# Altium schematic sheet LSM6DSOTR.SchDoc
size A3; SheetNumber: 4; SheetTotal: 7
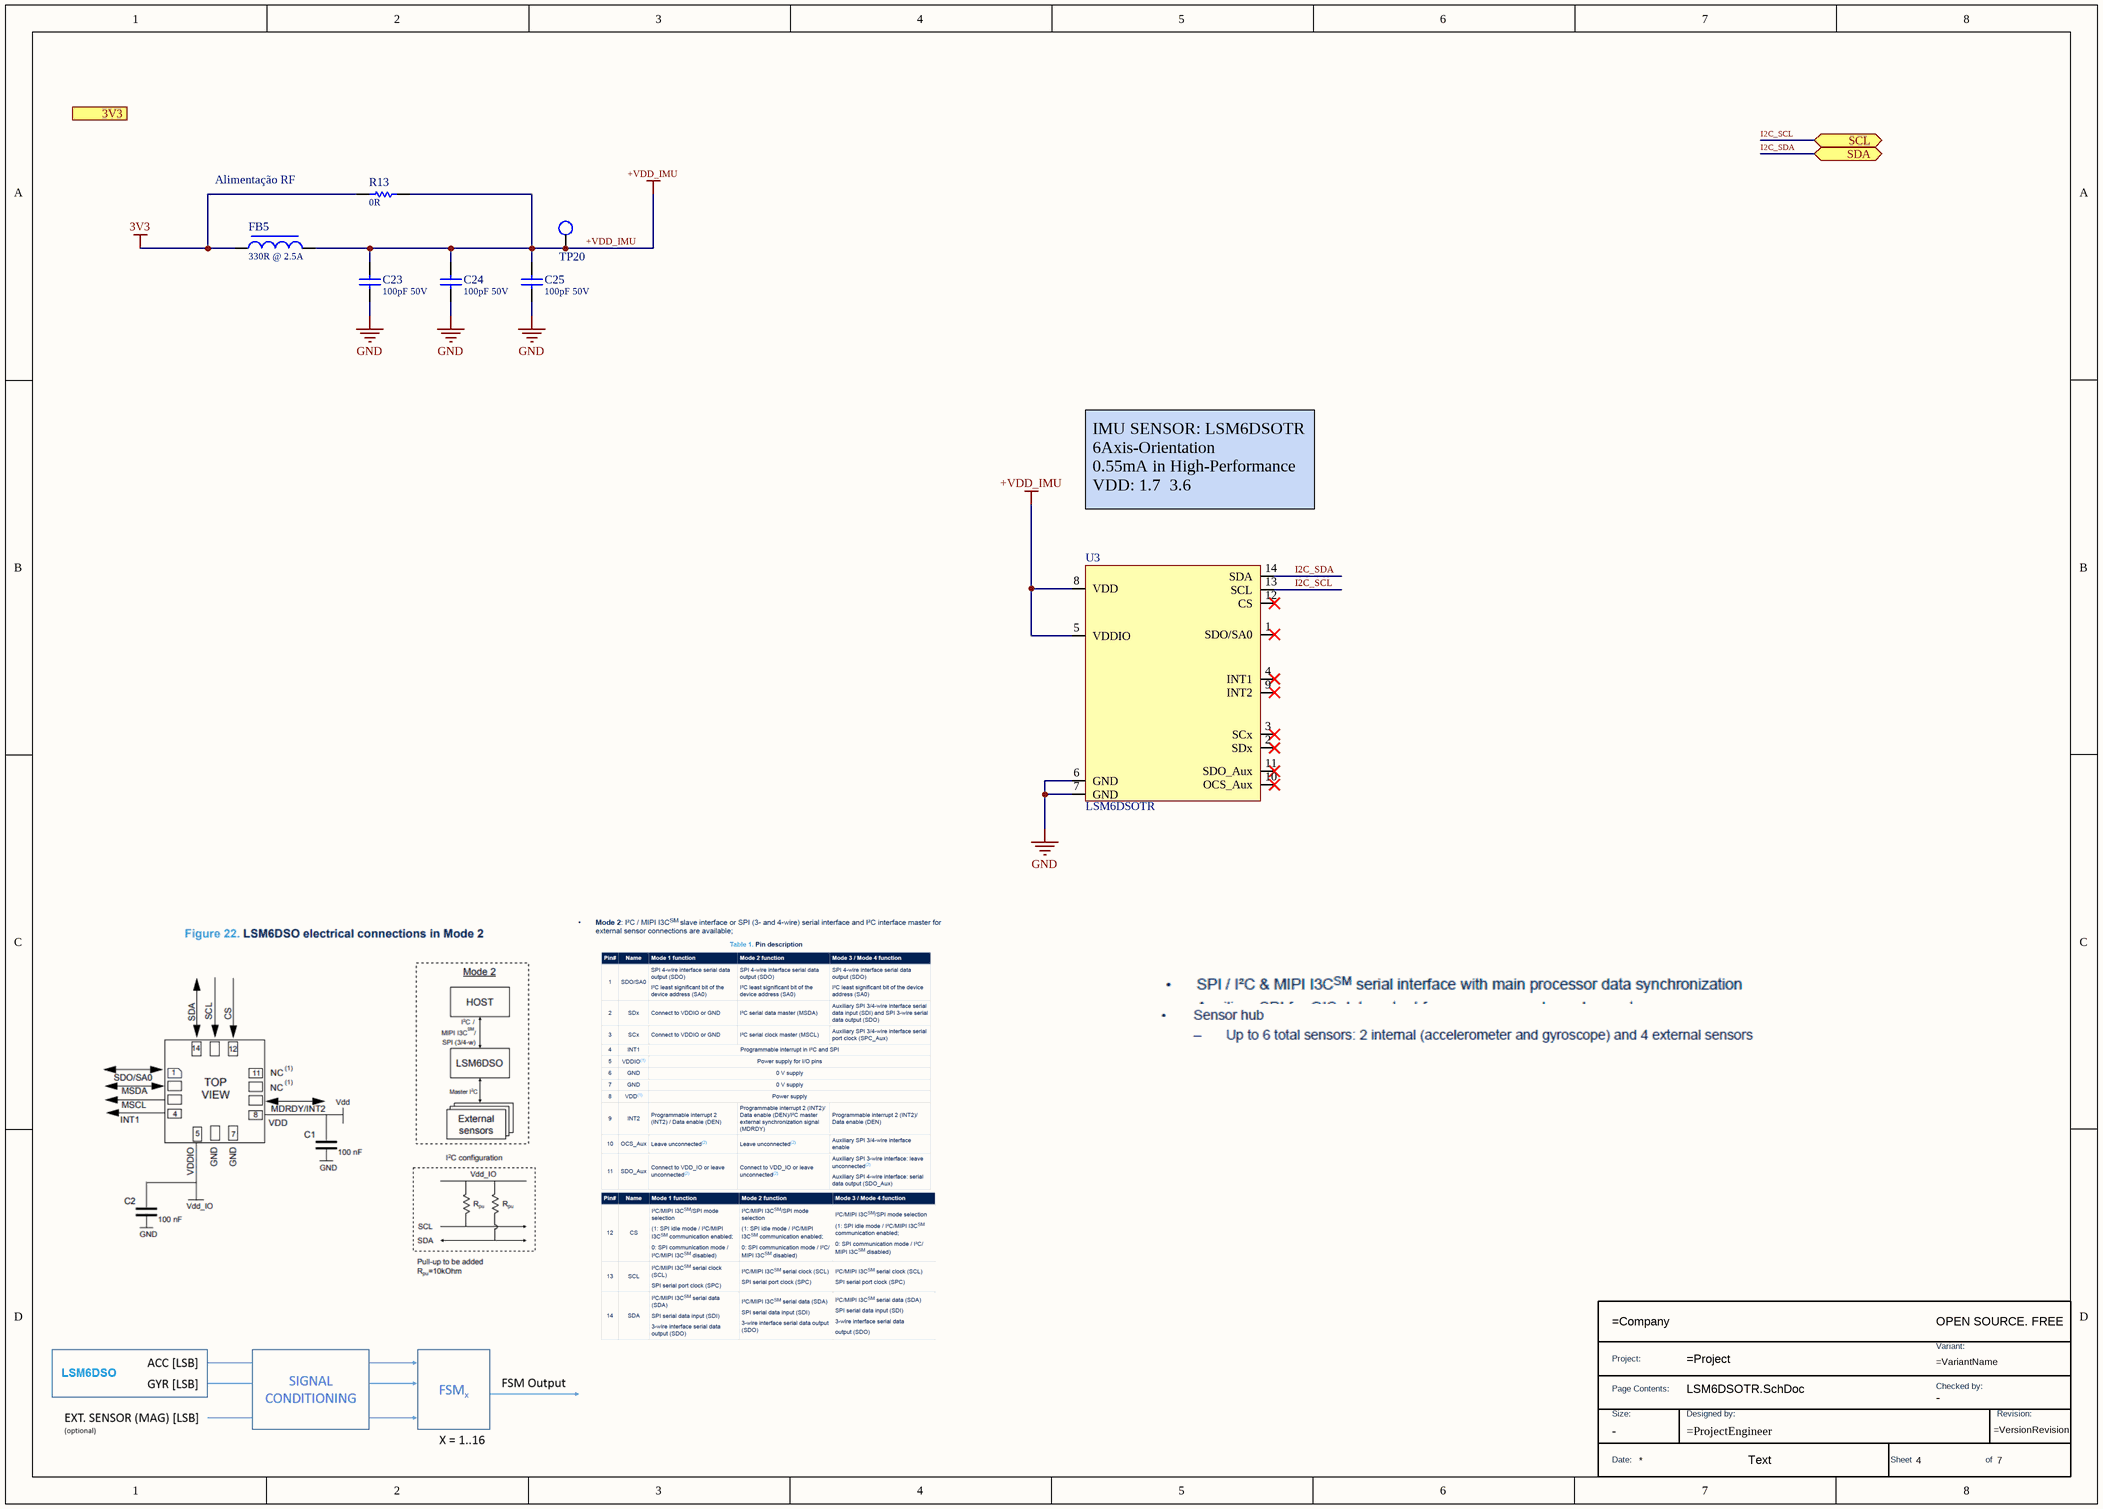
[diagram p0: LSM6DSOTR.SchDoc]

## Parts
*  TitleBlock  (value not drawn)  (graphical)
C23  Valor: 100pF 50V  [CAP_0805]  (hidden comment: CC0805JRNPO9BN101)
C24  Valor: 100pF 50V  [CAP_0805]  (hidden comment: CC0805JRNPO9BN101)
C25  Valor: 100pF 50V  [CAP_0805]  (hidden comment: CC0805JRNPO9BN101)
FB5  Valor: 330R @ 2.5A  [IND_0805]  (hidden comment: MPZ2012S331AT000)
R13  Valor: 0R  [RES_0805]  (hidden comment: RC0805JR-070RL)
TP20  TEST_POINT_1.5MM  [TESTPOINT_1.5MM]  (value not drawn)  (no BOM)
U3  LSM6DSOTR  [IC_IIM-42351]

## Ports
3V3 (in, see 1[6A], 3[8B], 5[1B], 6[1A], 7[1A]), SCL (bidir, see 1[6A], 6[8C]), SDA (bidir, see 1[6A], 6[8C])

## Nets
3V3: FB5.1 R13.1
+VDD_IMU: C23.2 C24.2 C25.2 FB5.2 R13.2 TP20.1 U3.5(VDDIO) U3.8(VDD)
GND: C23.1 C24.1 C25.1 U3.6(GND) U3.7(GND)
I2C_SCL: U3.13(SCL) ; port SCL
I2C_SDA: U3.14(SDA) ; port SDA

Not connected (* = marked no-connect by the designer): U3 1(SDO/SA0)* 2(SDx)* 3(SCx)* 4(INT1)* 9(INT2)* 10(OCS_Aux)* 11(SDO_Aux)* 12(CS)*

## Notes on the sheet
- Alimentação RF
- IMU SENSOR: LSM6DSOTR
  6Axis-Orientation
  0.55mA in High-Performance
  VDD: 1.7  3.6
- Todas as informações e detalhes técnicos deste documento são de inteira propriedade da empresa V2COM,
- não poderão ser copiados, reduzidos ou cedidos a terceiros sem prévia autorização por escrito da mesma.
- Salvo em (D/M/A):
- Página:
- de
- Nome do Projeto:
- https://v2com.com/
- Ed.:
- Responsável:
- Nome da página:
- Rev.:
- Projetista:
- Obs.:
- Revisor:
- Arquivo:
- -
- (in symbol TitleBlock) OPEN SOURCE. FREE; Project:; Variant:; Page Contents:; Checked by:; Size:; Designed by:; Revision:; Date:; Text; Sheet; of

## Library data of the parts
* = TitleBlock: Standard Title Block; DWG NO: =ProjectEngineer; Size: -; Checked by: -
C23-C25 = CC0805JRNPO9BN101: CAP CER 100PF 50V C0G/NPO 0805; Manufacturer: YAGEO; Origem: OBDH_Ed02; Case/Package: 0805; Manufacturer Part Number: CC0805JRNPO9BN101; Observação: *
FB5 = MPZ2012S331AT000: FERRITE BEAD 330 OHM 0805 1LN; Manufacturer: TDK Corporation; Case/Package: 0805; Manufacturer Part Number: MPZ2012S331AT000; Origem: *; Observação: *
R13 = RC0805JR-070RL: RES 0 OHM JUMPER 1/8W 0805; Manufacturer: YAGEO; Case/Package: 0805; Manufacturer Part Number: RC0805JR-070RL; Origem: *; Observação: *
TP20 = TEST_POINT_1.5MM: TEST_POINT; Origem: -; Case/Package: SMD; Manufacturer: -; Manufacturer Part Number: TEST_POINT; Observação: *; Valor: *
U3 = LSM6DSOTR: Accelerometer, Gyroscope, 6 Axis Sensor I²C, SPI Output